# EAGLE design LM399_breakout (EAGLE 7.2.0)
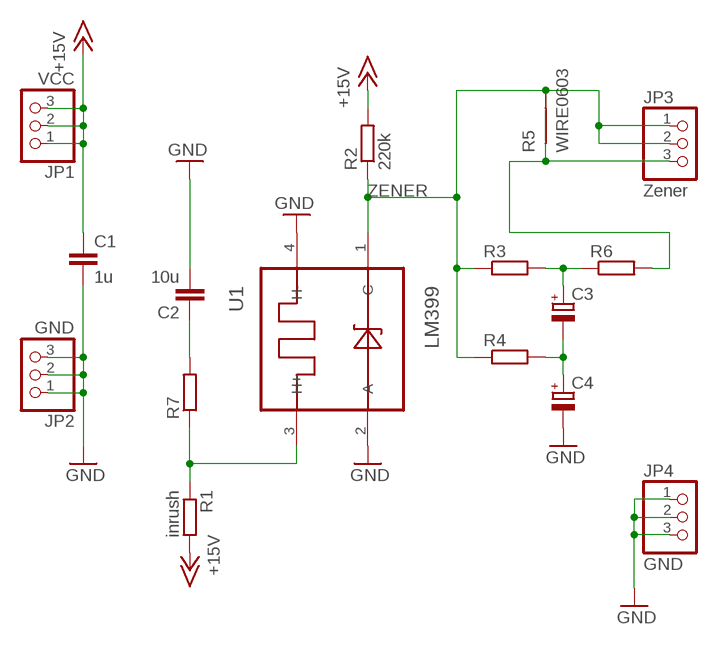
[diagram p0: schematic, sheet 1]

## Parts
C1  1u  C-EUC0805  [C0805]
C2  10u  C-EUC0805  [C0805]
C3  CPOL-EUSMCC  [SMC_C]
C4  CPOL-EUSMCC  [SMC_C]
JP1  VCC  PINHD-1X3TH_SMALL  [1X03_SMALL]
JP2  GND  PINHD-1X3TH_SMALL  [1X03_SMALL]
JP3  Zener  PINHD-1X3TH_SMALL  [1X03_SMALL]
JP4  GND  PINHD-1X3TH_SMALL  [1X03_SMALL]
R1  inrush  R-EU_0207/10  [0207/10]
R2  220k  R-EU_0207/10  [0207/10]
R3  R-EU_0207/10  [0207/10]
R4  R-EU_0207/10  [0207/10]
R5  WIRE0603  [R0603/BRIDGE]
R6  R-EU_0207/10  [0207/10]
R7  R-EU_R0603  [R0603]
U1  LM399  [H4-TO46-4PIN]

## Nets
+15V: C1.1 JP1.1 JP1.2 JP1.3 R1.2 R2.2
GND: C1.2 C2.2 C4.- JP2.1 JP2.2 JP2.3 JP4.1 JP4.2 JP4.3 U1.2(A) U1.4(H-)
N$1: R1.1 R7.1 U1.3(H+)
N$2: C2.1 R7.2
N$5: C3.- C4.+ R4.2
N$6: C3.+ R3.2 R6.1
ZENER: JP3.1 JP3.2 JP3.3 R2.1 R3.1 R4.1 R5.1 R5.2 R6.2 U1.1(C)

## Library data of the parts
C1 C2 = SquantorRCL:C-EU: CAPACITOR, European symbol
C3 C4 = SquantorRCL:CPOL-EU: POLARIZED CAPACITOR, European symbol
JP1-JP4 = SquantorConnectors:PINHD-1X3: PIN HEADER
R1-R4 R6 R7 = SquantorRCL:R-EU_: RESISTOR, European symbol
R5 = SquantorRCL:WIRE
U1 = SquantorLinearTechnology:LM399

## Board
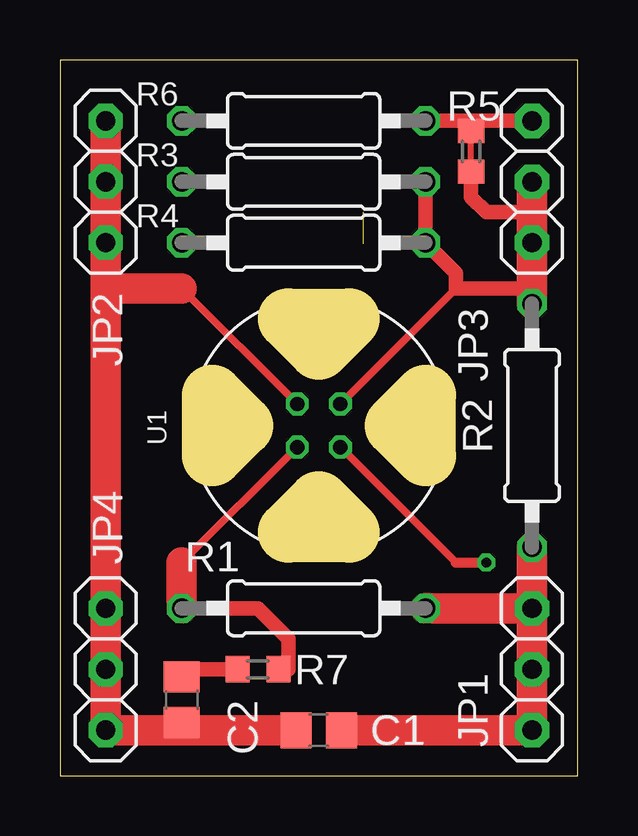
[diagram p1: board, top side]
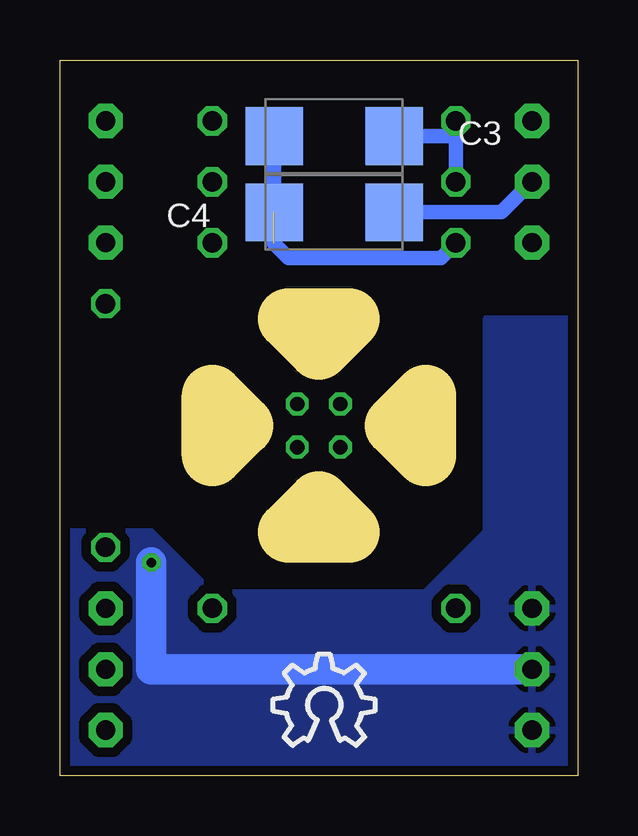
[diagram p2: board, bottom side, seen from below]

Size 21.59 x 29.84 mm. Coordinates in mm from the lower left corner, seen from the top.
Outline: 21.59,29.84 0,29.84 0,0 21.59,0 21.59,29.84
Outline: 7.62,14.61 6.35,15.88 6.35,13.34 7.62,14.61
Outline: 10.8,11.43 12.07,10.16 9.53,10.16 10.8,11.43
Outline: 13.97,14.61 15.24,13.34 15.24,15.88 13.97,14.61
Outline: 10.8,17.78 9.53,19.05 12.07,19.05 10.8,17.78
Copper layers (1*16): Top 0.0356mm / dielectric 1.5011mm / Bottom 0.0356mm
Design rules "OSHPark": minimum track width 6mil, minimum drill 13mil, track to track 6mil, track to pad 6mil, pad to pad 6mil, via to via 6mil, smd to smd 6mil, copper to edge 15mil, drill to drill 6mil, minimum pad ring 7mil, minimum via ring 7mil, stop-mask expansion 3mil, vias tented up to drill 0mil, thermal gap 10mil

### Footprints (pad centres in the part's own frame; a part is rotated, then mirrored left to right if it is on the bottom)
C0805 = smd 1.3 x 1.5: 1 -0.95,0; 2 0.95,0
SMC_C = smd 2.4 x 2.4: + -2.5,0; - 2.5,0
1X03_SMALL = drill 0.8 pad 1.422 octagon: 1 -2.54,0; 2 0,0; 3 2.54,0
0207/10 = drill 0.813 octagon: 1 -5.08,0; 2 5.08,0
R0603/BRIDGE = smd 1 x 1.1: 1 -0.85,0; 2 0.85,0
R0603 = smd 1 x 1.1: 1 -0.85,0; 2 0.85,0
H4-TO46-4PIN = drill 0.6 octagon: 1 -1.27,0; 2 0,-1.27; 3 1.27,0; 4 0,1.27

### Placement (x,y rotation side)
C1  10.8,1.91 180 top
C2  5.08,3.17 270 top
C3  10.16,26.67 180 bottom
C4  10.16,23.49 0 bottom
JP1  19.69,4.45 90 top
JP2  1.91,24.76 90 top
JP3  19.69,24.76 90 top
JP4  1.91,4.45 90 top
R1  10.16,6.99 0 top
R2  19.69,14.61 270 top
R3  10.16,24.76 180 top
R4  10.16,22.22 180 top
R5  17.14,26.04 270 top
R6  10.16,27.3 0 top
R7  8.25,4.45 180 top
U1  10.8,14.61 225 top
U$1  [OSHW_8X150_NOTEXT]  12.7,1.27 0 bottom

### Tracks (layer width: path | path; a pad name or v marks a point on that pad's centre or on a via)
+15V
  Top 1.27: JP1.3 JP1.2 JP1.1 C1.1 | JP1.3 R2.2 | JP1.3 R1.2
GND  (via drill 0.4)
  Top 0.305: U1.2 | U1.2 5.08,20.32 | U1.4 | U1.4 16.51,8.89
  Top 0.406: 16.51,8.89 v17.78,8.89
  Top 1.27: JP2.3 JP2.2 JP2.1 1.91,20.32 | 5.08,20.32 1.91,20.32 | 5.08,1.91 JP4.1 JP4.2 JP4.3 1.91,20.32 | 5.08,1.91 C1.2 | C2.2 5.08,1.91
  Bottom 0.61: C4.- 3.17,23.49 JP2.2
  Bottom 1.27: v17.78,8.89 17.78,4.45 JP4.2
  pour Bottom (isolate 0.406): 21.59,10.16 17.78,10.16 15.24,7.62 6.35,7.62 4.44,9.53 3.81,10.16 3.81,19.05 0,19.05 0,0 21.59,0
N$1
  Top 0.305: U1.3 5.08,8.89
  Top 0.61: R1.1 8.25,6.99 9.53,5.71 9.53,4.45 R7.1
  Top 1.27: 5.08,8.89 R1.1
N$2
  Top 0.61: R7.2 5.71,4.45 5.4,4.12 C2.1
N$5  (1 unrouted)
  Bottom 0.61: R4.2 5.71,21.59 12.07,21.59 12.66,22.18 C3.-
N$6
  Bottom 0.61: R3.2 5.08,26.67 | 5.08,26.67 R6.1 | C3.+ 5.08,26.67
ZENER
  Top 0.254: R5.2 R5.1
  Top 0.305: U1.1 16.51,20.32
  Top 0.61: 19.69,20.32 16.51,20.32 16.51,20.95 R4.1 R3.1 | R5.2 17.14,24.13 17.78,23.49 19.69,23.49 | R6.2 17.14,27.3 | 17.14,27.3 R5.1 | 17.14,27.3 JP3.3
  Top 1.27: R2.1 19.69,20.32 JP3.1 19.69,23.49 JP3.2